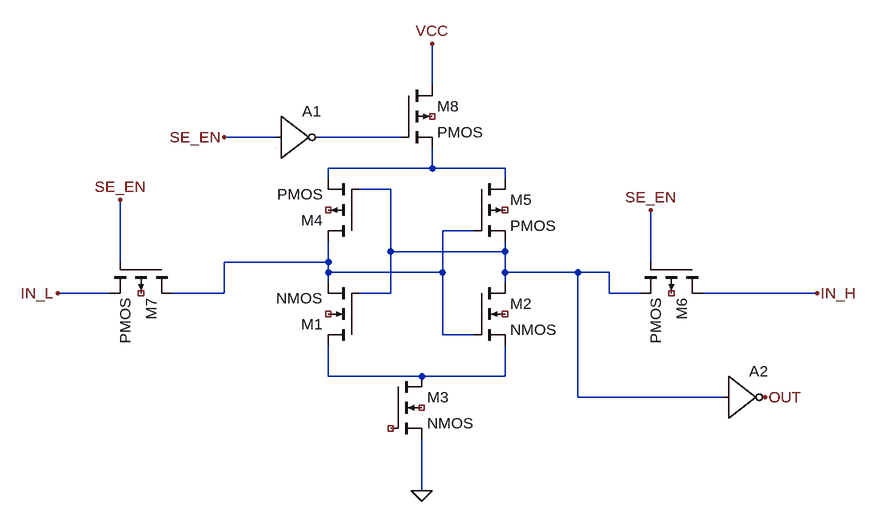
[diagram p0: schematic SES_amp.asc]
SES_amp.asc, the LTspice schematic file:
Version 4
SHEET 1 912 680
WIRE 240 -192 240 -256
WIRE 0 -112 -80 -112
WIRE 192 -112 64 -112
WIRE 240 -64 240 -96
WIRE 240 -64 80 -64
WIRE 352 -64 240 -64
WIRE 80 -48 80 -64
WIRE 352 -48 352 -64
WIRE 176 -32 128 -32
WIRE 304 32 256 32
WIRE 176 64 176 -32
WIRE 352 64 352 48
WIRE 352 64 176 64
WIRE -240 80 -240 -16
WIRE 80 80 80 48
WIRE 80 80 -80 80
WIRE 576 80 576 0
WIRE 80 96 80 80
WIRE 256 96 256 32
WIRE 256 96 80 96
WIRE 352 96 352 64
WIRE 464 96 352 96
WIRE 512 96 464 96
WIRE 80 112 80 96
WIRE 352 112 352 96
WIRE -256 128 -336 128
WIRE -80 128 -80 80
WIRE -80 128 -160 128
WIRE 176 128 176 64
WIRE 176 128 128 128
WIRE 512 128 512 96
WIRE 560 128 512 128
WIRE 832 128 656 128
WIRE 256 192 256 96
WIRE 304 192 256 192
WIRE 80 256 80 208
WIRE 224 256 80 256
WIRE 352 256 352 208
WIRE 352 256 224 256
WIRE 464 288 464 96
WIRE 688 288 464 288
WIRE 224 432 224 352
FLAG 224 432 0
FLAG 240 -256 VCC
FLAG 576 0 SE_EN
FLAG -240 -16 SE_EN
FLAG -336 128 IN_L
FLAG 832 128 IN_H
FLAG -80 -112 SE_EN
FLAG 752 288 OUT
SYMBOL nmos4 128 208 R180
SYMATTR InstName M1
SYMBOL nmos4 304 112 R0
SYMATTR InstName M2
SYMBOL nmos4 176 256 R0
SYMATTR InstName M3
SYMBOL pmos4 128 48 R180
SYMATTR InstName M4
SYMBOL pmos4 304 -48 R0
SYMATTR InstName M5
SYMBOL pmos4 656 80 R90
SYMATTR InstName M6
SYMBOL pmos4 -160 80 R90
SYMATTR InstName M7
SYMBOL pmos4 192 -192 R0
SYMATTR InstName M8
SYMBOL Digital\\inv 0 -176 R0
SYMATTR InstName A1
SYMBOL Digital\\inv 688 224 R0
SYMATTR InstName A2

The netlist it stands for:
* SES_amp.asc
M1 N005 N003 N004 NC_01 NMOS
M2 N003 N004 N005 NC_02 NMOS
M3 N005 NC_03 0 NC_04 NMOS
M4 N004 N003 N002 NC_05 PMOS
M5 N002 N004 N003 NC_06 PMOS
M6 IN_H SE_EN N003 NC_07 PMOS
M7 N004 SE_EN IN_L NC_08 PMOS
M8 VCC N001 N002 NC_09 PMOS
A1 SE_EN 0 0 0 0 N001 0 0 BUF
A2 N003 0 0 0 0 OUT 0 0 BUF
.model NMOS NMOS
.model PMOS PMOS
.lib standard.mos
.backanno
.end